# EAGLE design buzzer (EAGLE 7.1.0)
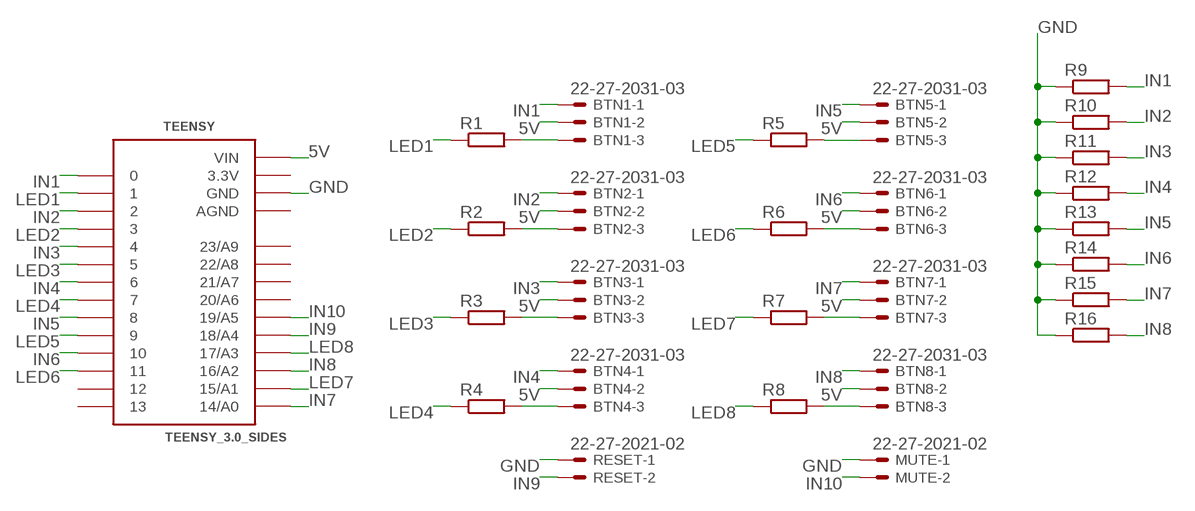
[diagram p0: schematic, sheet 1]

## Parts
BTN1  22-27-2031-03  [6410-03]
BTN2  22-27-2031-03  [6410-03]
BTN3  22-27-2031-03  [6410-03]
BTN4  22-27-2031-03  [6410-03]
BTN5  22-27-2031-03  [6410-03]
BTN6  22-27-2031-03  [6410-03]
BTN7  22-27-2031-03  [6410-03]
BTN8  22-27-2031-03  [6410-03]
MUTE  22-27-2021-02  [6410-02]
R1  R0207/10  [0207/10]
R2  R0207/10  [0207/10]
R3  R0207/10  [0207/10]
R4  R0207/10  [0207/10]
R5  R0207/10  [0207/10]
R6  R0207/10  [0207/10]
R7  R0207/10  [0207/10]
R8  R0207/10  [0207/10]
R9  R0207/10  [0207/10]
R10  R0207/10  [0207/10]
R11  R0207/10  [0207/10]
R12  R0207/10  [0207/10]
R13  R0207/10  [0207/10]
R14  R0207/10  [0207/10]
R15  R0207/10  [0207/10]
R16  R0207/10  [0207/10]
RESET  22-27-2021-02  [6410-02]
TEENSY  TEENSY_3.0_SIDES  [TEENSY_3.0_SIDES]

## Nets
5V: BTN1.2 BTN2.2 BTN3.2 BTN4.2 BTN5.2 BTN6.2 BTN7.2 BTN8.2 TEENSY.VIN
GND: MUTE.1 R9.1 R10.1 R11.1 R12.1 R13.1 R14.1 R15.1 R16.1 RESET.1 TEENSY.GND
IN1: BTN1.1 R9.2 TEENSY.0
IN2: BTN2.1 R10.2 TEENSY.2
IN3: BTN3.1 R11.2 TEENSY.4
IN4: BTN4.1 R12.2 TEENSY.6
IN5: BTN5.1 R13.2 TEENSY.8
IN6: BTN6.1 R14.2 TEENSY.10
IN7: BTN7.1 R15.2 TEENSY.14/A0
IN8: BTN8.1 R16.2 TEENSY.16/A2
IN9: RESET.2 TEENSY.18/A4
IN10: MUTE.2 TEENSY.19/A5
LED1: R1.1 TEENSY.1
LED2: R2.1 TEENSY.3
LED3: R3.1 TEENSY.5
LED4: R4.1 TEENSY.7
LED5: R5.1 TEENSY.9
LED6: R6.1 TEENSY.11
LED7: R7.1 TEENSY.15/A1
LED8: R8.1 TEENSY.17/A3
N$1: BTN1.3 R1.2
N$2: BTN4.3 R4.2
N$3: BTN5.3 R5.2
N$4: BTN7.3 R7.2
N$5: BTN8.3 R8.2
N$6: BTN2.3 R2.2
N$9: BTN3.3 R3.2
N$18: BTN6.3 R6.2
Unconnected: TEENSY.12 TEENSY.13 TEENSY.20/A6 TEENSY.21/A7 TEENSY.22/A8 TEENSY.23/A9

## Power pins joined to a net without a drawn wire
3.3V: TEENSY.3.3V
AGND: TEENSY.AGND

## Library data of the parts
BTN1-BTN8 = con-molex:22-?-03: CONNECTOR wire to board 2.54 mm (.1 inch) pitch header; OC_FARNELL: unknown; OC_NEWARK: unknown
MUTE RESET = con-molex:22-?-02: CONNECTOR wire to board 2.54 mm (.1 inch) pitch header; OC_FARNELL: unknown; OC_NEWARK: unknown
R1-R16 = eagle-ltspice:R: RESISTOR, European symbol; SPICEMODEL: NONE; SPICEPREFIX: R
TEENSY = Teensy3.0:TEENSY_3.0_SIDES: Teensy 3.0 Board outline with only side pins.

## Board
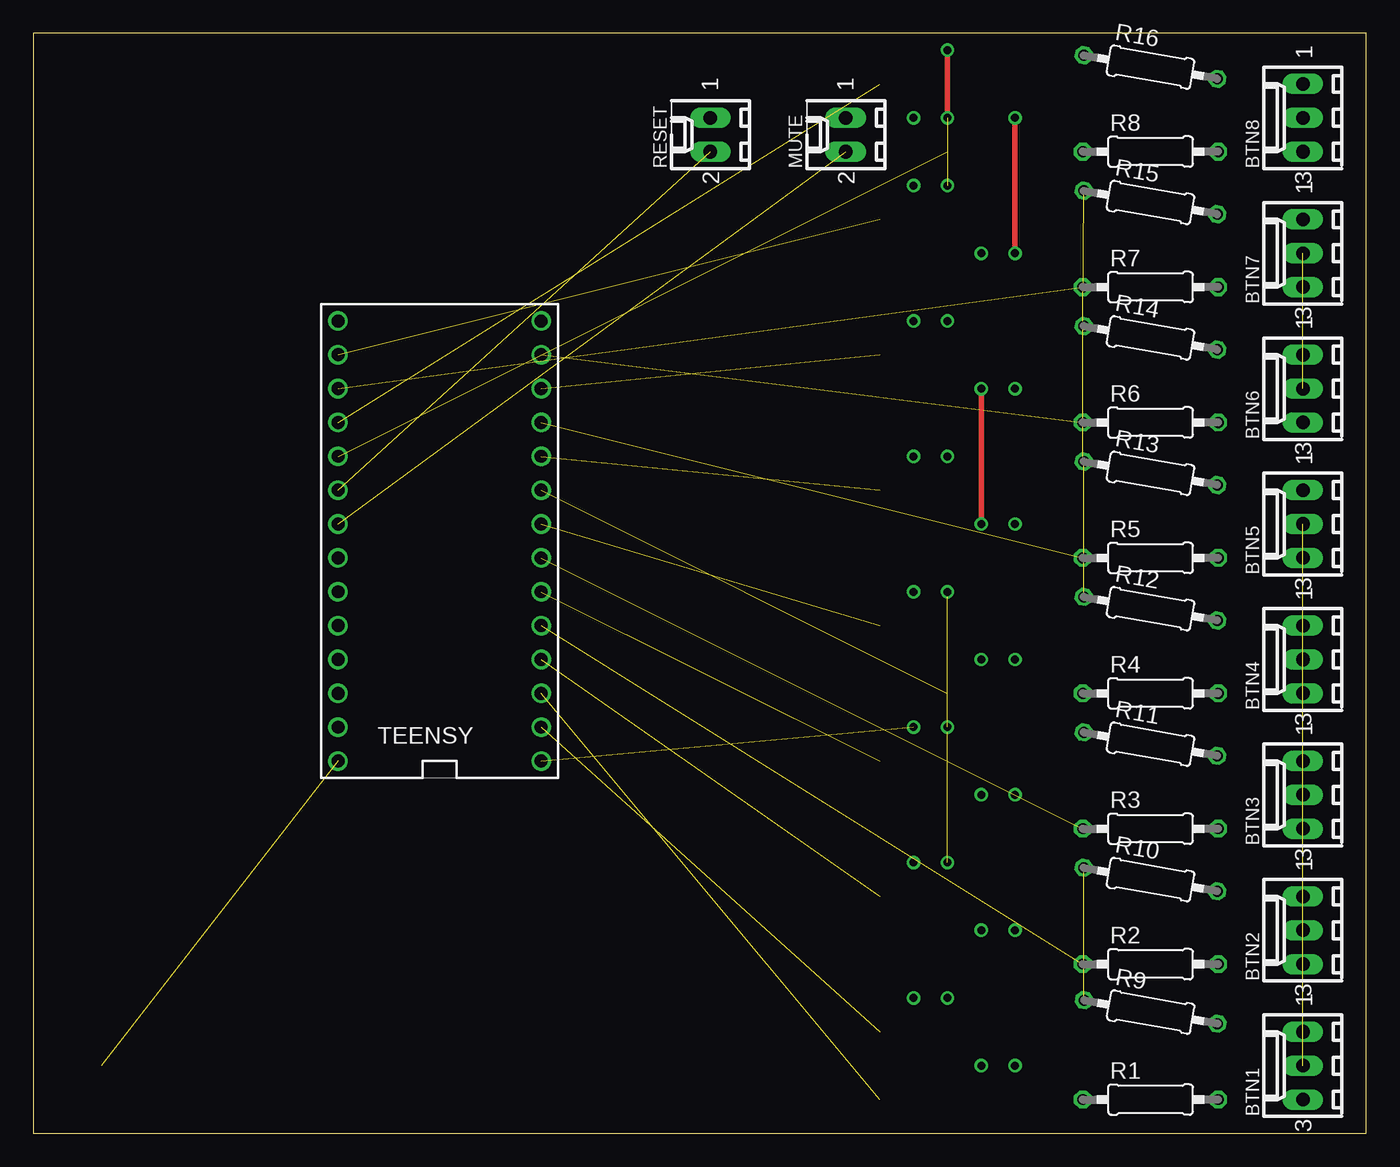
[diagram p1: board, top side]
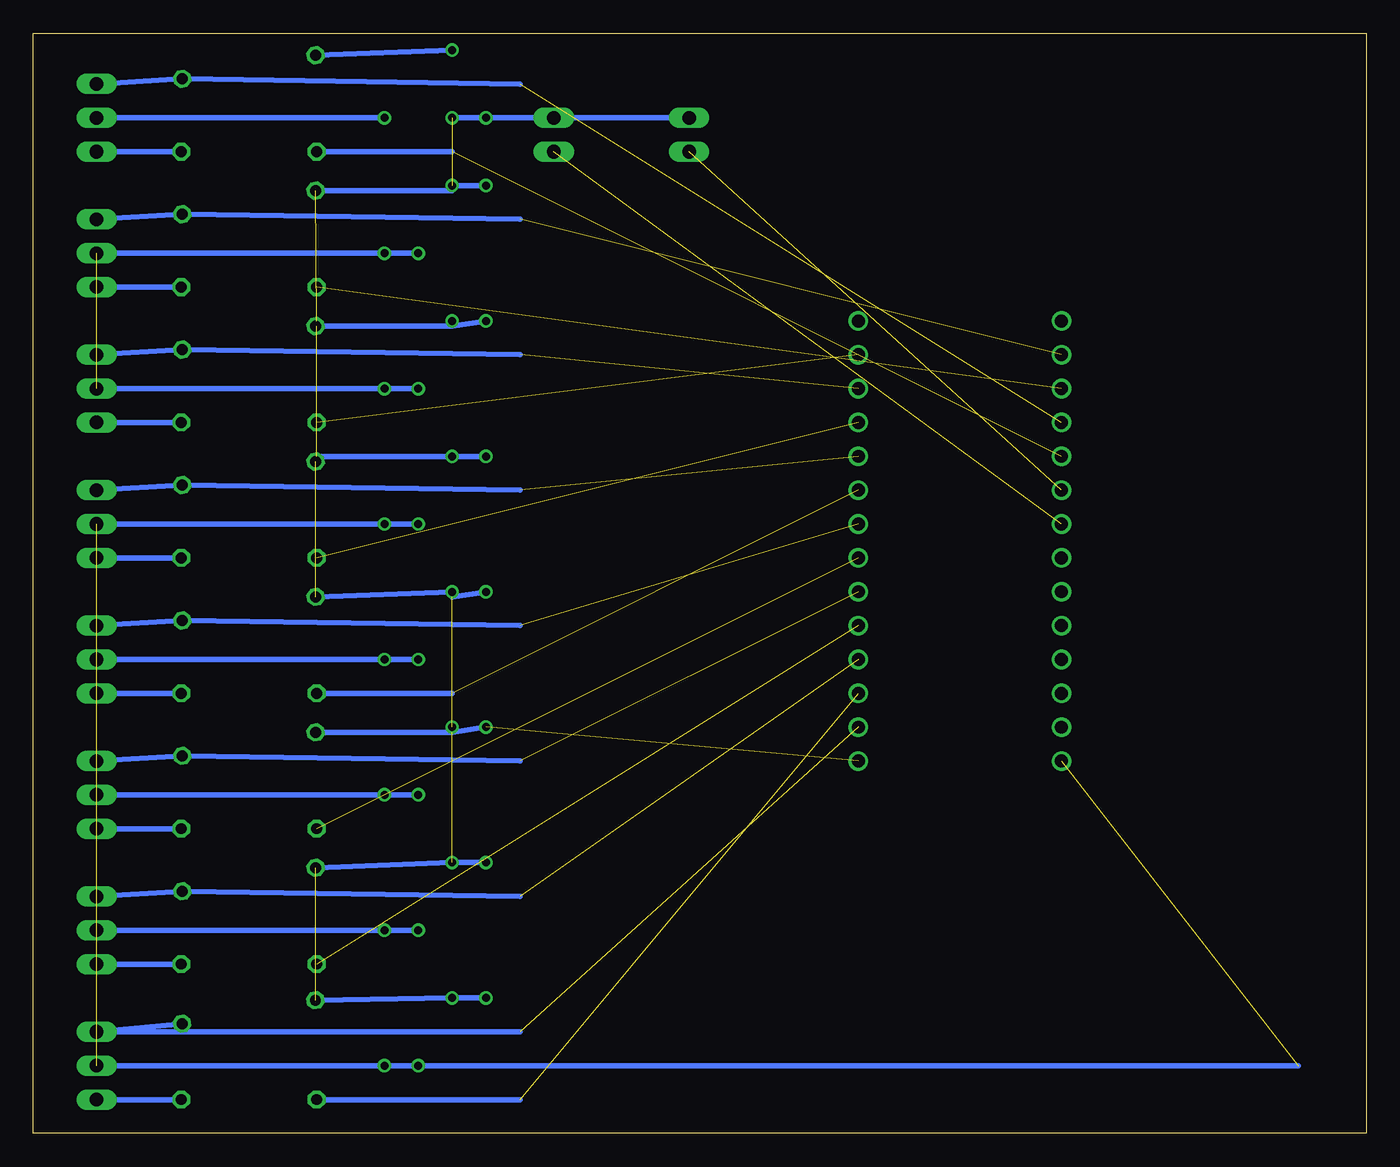
[diagram p2: board, bottom side, seen from below]

Size 100 x 82.54 mm. Coordinates in mm from the lower left corner, seen from the top.
Outline: 0,0 100,0 100,82.54 0,82.54 0,0
Copper layers (1*16): Top 0.035mm / dielectric 1.5mm / Bottom 0.035mm
Design rules "default": minimum track width 10mil, minimum drill 24mil, track to track 8mil, track to pad 8mil, pad to pad 8mil, via to via 8mil, smd to smd 8mil, copper to edge 40mil, drill to drill 8mil, minimum pad ring 10mil, minimum via ring 8mil, stop-mask expansion 4mil, vias tented up to drill 0mil, thermal gap 10mil

### Footprints (pad centres in the part's own frame; a part is rotated, then mirrored left to right if it is on the bottom)
6410-03 = drill 1.016 long: 1 2.54,0; 2 0,0; 3 -2.54,0
6410-02 = drill 1.016 long: 1 1.27,0; 2 -1.27,0
0207/10 = drill 0.813 octagon: 1 -5.08,0; 2 5.08,0
TEENSY_3.0_SIDES = drill 0.965: 0 -7.62,13.97; 1 -7.62,11.43; 2 -7.62,8.89; 3 -7.62,6.35; 3.3V 7.62,11.43; 4 -7.62,3.81; 5 -7.62,1.27; 6 -7.62,-1.27; 7 -7.62,-3.81; 8 -7.62,-6.35; 9 -7.62,-8.89; 10 -7.62,-11.43; 11 -7.62,-13.97; 12 -7.62,-16.51; 13 7.62,-16.51; 14/A0 7.62,-13.97; 15/A1 7.62,-11.43; 16/A2 7.62,-8.89; 17/A3 7.62,-6.35; 18/A4 7.62,-3.81; 19/A5 7.62,-1.27; 20/A6 7.62,1.27; 21/A7 7.62,3.81; 22/A8 7.62,6.35; 23/A9 7.62,8.89; AGND 7.62,13.97; GND -7.62,16.51; VIN 7.62,16.51

### Placement (x,y rotation side)
BTN1  95.25,5.08 90 top
BTN2  95.25,15.24 90 top
BTN3  95.25,25.4 90 top
BTN4  95.25,35.56 90 top
BTN5  95.25,45.72 90 top
BTN6  95.25,55.88 90 top
BTN7  95.25,66.04 90 top
BTN8  95.25,76.2 90 top
MUTE  60.96,74.93 90 top
R1  83.82,2.54 0 top
R2  83.82,12.7 0 top
R3  83.82,22.86 0 top
R4  83.82,33.02 0 top
R5  83.82,43.18 0 top
R6  83.82,53.34 0 top
R7  83.82,63.5 0 top
R8  83.82,73.66 0 top
R9  83.84,9.11 350 top
R10  83.82,19.05 350 top
R11  83.82,29.21 350 top
R12  83.82,39.37 350 top
R13  83.82,49.53 350 top
R14  83.82,59.69 350 top
R15  83.82,69.85 350 top
R16  83.82,80.01 350 top
RESET  50.8,74.93 90 top
TEENSY  30.48,44.45 180 top

### Tracks (layer width: path | path; a pad name or v marks a point on that pad's centre or on a via)
5V  (via drill 0.6)  (6 unrouted)
  Top 0.406: v73.66,76.2 v73.66,66.04 | v71.12,55.88 v71.12,45.72
  Bottom 0.406: BTN8.2 v73.66,76.2 | BTN7.2 v73.66,66.04 71.12,66.04 | BTN1.2 v73.66,5.08 v71.12,5.08 5.08,5.08 | BTN5.2 v73.66,45.72 v71.12,45.72 | BTN6.2 v73.66,55.88 v71.12,55.88 | BTN4.2 v73.66,35.56 71.12,35.56 | BTN3.2 v73.66,25.4 71.12,25.4 | BTN2.2 v73.66,15.24 71.12,15.24
GND  (via drill 0.6)  (8 unrouted)
  Top 0.406: v68.58,81.28 v68.58,76.2
  Bottom 0.406: RESET.1 MUTE.1 v66.04,76.2 v68.58,76.2 | R16.1 v68.58,81.28 | R10.1 v68.58,20.32 66.04,20.32 | R11.1 68.58,30.09 | 68.58,30.09 v68.58,30.48 | R15.1 68.58,70.73 v68.58,71.12 66.04,71.12 | 78.74,60.96 78.74,60.57 R14.1 68.58,60.57 | R13.1 78.74,50.41 78.74,50.8 66.04,50.8 | 68.58,60.57 68.58,60.96 | 68.58,60.57 66.04,60.96 | 68.58,30.09 66.04,30.48 | R9.1 v68.58,10.16 66.04,10.16 | R12.1 v68.58,40.64 68.58,40.25 66.04,40.64
IN1  (1 unrouted)
  Bottom 0.406: R9.2 BTN1.1 63.5,7.62
IN2  (1 unrouted)
  Bottom 0.406: BTN2.1 R10.2 63.5,17.78
IN3  (1 unrouted)
  Bottom 0.406: BTN3.1 R11.2 63.5,27.94
IN4  (1 unrouted)
  Bottom 0.406: BTN4.1 R12.2 63.5,38.1
IN5  (1 unrouted)
  Bottom 0.406: BTN5.1 R13.2 63.5,48.26
IN6  (1 unrouted)
  Bottom 0.406: BTN6.1 R14.2 63.5,58.42
IN7  (1 unrouted)
  Bottom 0.406: BTN7.1 R15.2 63.5,68.58
IN8  (1 unrouted)
  Bottom 0.406: BTN8.1 R16.2 63.5,78.74
IN9  (1 unrouted)
IN10  (1 unrouted)
LED1  (1 unrouted)
  Bottom 0.406: R1.1 63.5,2.54
LED2  (1 unrouted)
LED3  (1 unrouted)
LED4  (1 unrouted)
  Bottom 0.406: R4.1 68.58,33.02
LED5  (1 unrouted)
LED6  (1 unrouted)
LED7  (1 unrouted)
LED8  (1 unrouted)
  Bottom 0.406: R8.1 68.58,73.66
N$1
  Bottom 0.406: R1.2 BTN1.3
N$2
  Bottom 0.406: R4.2 BTN4.3
N$3
  Bottom 0.406: R5.2 BTN5.3
N$4
  Bottom 0.406: R7.2 BTN7.3
N$5
  Bottom 0.406: R8.2 BTN8.3
N$6
  Bottom 0.406: R2.2 BTN2.3
N$7  (via drill 0.6)
  other vias: 68.58,50.8
N$8  (via drill 0.6)
  other vias: 68.58,60.96
N$9
  Bottom 0.406: R3.2 BTN3.3
N$10  (via drill 0.6)
  other vias: 66.04,71.12
N$11  (via drill 0.6)
  other vias: 66.04,60.96
N$12  (via drill 0.6)
  other vias: 66.04,50.8
N$13  (via drill 0.6)
  other vias: 66.04,40.64
N$14  (via drill 0.6)
  other vias: 66.04,30.48
N$15  (via drill 0.6)
  other vias: 66.04,20.32
N$16  (via drill 0.6)
  other vias: 66.04,10.16
N$18
  Bottom 0.406: R6.2 BTN6.3
N$19  (via drill 0.6)
  other vias: 71.12,66.04
N$22  (via drill 0.6)
  other vias: 71.12,35.56
N$23  (via drill 0.6)
  other vias: 71.12,25.4
N$24  (via drill 0.6)
  other vias: 71.12,15.24